# Altium project Eslam.PrjPcb
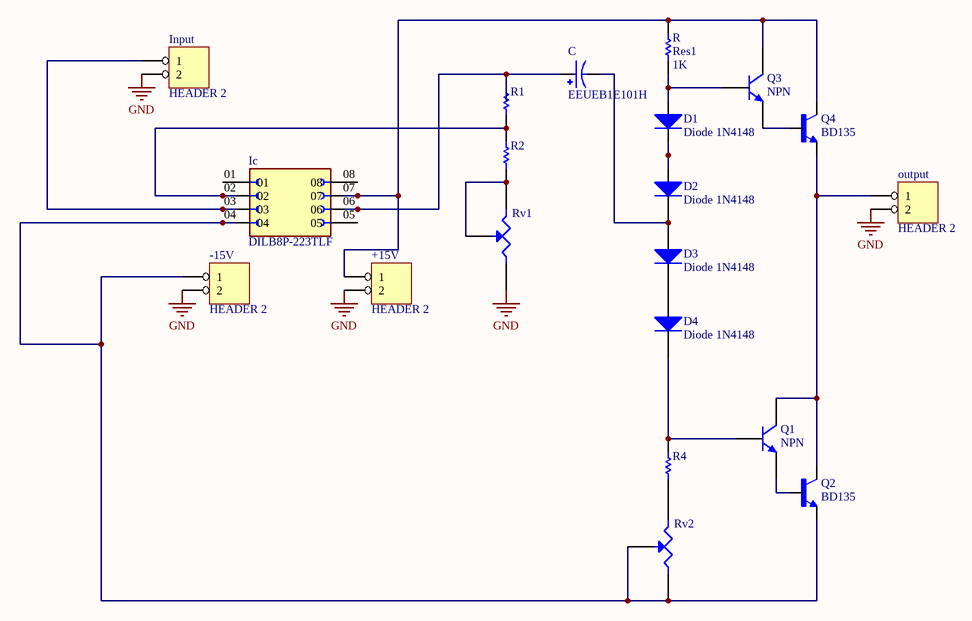
[diagram p0: Sheet1.SchDoc]
1 sheet, 20 parts. Net scope: global (net labels, ports and power ports of the same name join across sheets).
Board file: PCB1.PcbDoc

## Sheet Sheet1.SchDoc
size A; SheetNumber: 1; SheetTotal: 1; SPICEModelCacheRGWDUTJM: <root> / <DocumentId>RGWDUTJM</DocumentId> / <CacheFrame Number="0"> / <Model Name="npn" Kind="MDL"> / <Text>*Default NPN BJT / *NPN Trans Pinout: C,B,E / .MODEL NPN NPN()</Text> / </Model> / <Model Name="1n4148" Kind="MDL"> / <Text>.model 1N4148  D(Is=0.1p Rs=16 CJO=2p Tt=12n Bv=100 Ibv=0.1p)</Text> / </Model> / </CacheFrame> / </root>

### Parts
+15V  HEADER 2  [RAD0.2]
-15V  HEADER 2  [RAD0.2]
C  EEUEB1E101H  [CAPPRD250W50D630H1500]
D1  Diode 1N4148  [DO-35]
D2  Diode 1N4148  [DO-35]
D3  Diode 1N4148  [DO-35]
D4  Diode 1N4148  [DO-35]
Ic  DILB8P-223TLF  [AMPHENOL_DILB8P-223TLF]
Input  HEADER 2  [RAD0.2]
output  HEADER 2  [RAD0.2]
Q1  NPN  [TO-226-AA]
Q2  BD135  [TO229P780X300X2000-3]
Q3  NPN  [TO-226-AA]
Q4  BD135  [TO229P780X300X2000-3]
R  Res1  value 1K  [AXIAL-0.3]
R1  (no value)  [AXIAL-0.3]
R2  (no value)  [AXIAL-0.3]
R4  (no value)  [AXIAL-0.3]
Rv1  (no value)  [POT]
Rv2  (no value)  [POT]

### Nets
GND: +15V.2 -15V.2 Input.2 output.2 Rv1.1
Net+15V_1: +15V.1 Ic.07 Q3.1(C) Q4.2(C) R.2
Net-15V_1: -15V.1 Ic.04 Q2.1(E) Rv2.1 Rv2.2
NetC_N: C.N D2.2(K) D3.1(A)
NetC_P: C.P Ic.06 R1.2
NetD1_1: D1.1(A) Q3.2(B) R.1
NetD1_2: D1.2(K) D2.1(A)
NetD3_2: D3.2(K) D4.1(A)
NetD4_2: D4.2(K) Q1.2(B) R4.2
NetIc_02: Ic.02 R1.1 R2.2
NetIc_03: Ic.03 Input.1
Netoutput_1: output.1 Q1.1(C) Q2.2(C) Q4.1(E)
NetQ1_3: Q1.3(E) Q2.3(B)
NetQ3_3: Q3.3(E) Q4.3(B)
NetR2_1: R2.1 Rv1.2 Rv1.3
NetR4_1: R4.1 Rv2.3

Not connected (* = marked no-connect by the designer): Ic 01 05 08

### Library data of the parts
C = EEUEB1E101H: CAP ALUM 100UF 20% 25V RADIAL; MP: EEU-EB1E101H; MF: Panasonic Electronic Components; Package: RADIAL-2 Panasonic; SnapEDA_Link: https://www.snapeda.com/parts/EEU-EB1E101H/Panasonic/view-part/6221297/?ref=snap; Check_prices: https://www.snapeda.com/parts/EEU-EB1E101H/Panasonic/view-part/6221297/?ref=eda; Price: None; Value: *; Availability: Not in stock
D1-D4 = Diode 1N4148: High Conductance Fast Diode; Published: 8-Jun-2000; LatestRevisionDate: 17-Jul-2002; LatestRevisionNote: Re-released for DXP Platform.; DatasheetVersion: 1997; PackageReference: DO-35; Publisher: Altium Limited; PackageDescription: Diode, Axial; Body 3.8 x 1.9 mm (LxDia. max), Lead Dia. 0.53 mm (max); Code_JEDEC: DO-204-AH; ComponentLink1Description: Manufacturer Link; ComponentLink1URL: http://www.fairchildsemi.com/; ComponentLink2Description: Datasheet; ComponentLink2URL: http://www.fairchildsemi.com/ds/1N%2F1N4148.pdf
Ic = DILB8P-223TLF: DIP Socket, Stamped and Formed; MF: Amphenol ICC; MP: DILB8P-223TLF; SnapEDA_Link: https://www.snapeda.com/parts/DILB8P-223TLF/Amphenol+FCI/view-part/?ref=snap; Availability: In Stock; Package: None; Check_prices: https://www.snapeda.com/parts/DILB8P-223TLF/Amphenol+FCI/view-part/?ref=eda; Value: *; Purchase-URL: https://pricing.snapeda.com/search/part/DILB8P-223TLF/?ref=eda; Price: None
Q1 Q3 = NPN: NPN Bipolar Transistor; Published: 8-Jun-2000; LatestRevisionDate: 17-Jul-2002; LatestRevisionNote: Re-released for DXP Platform.; PackageReference: TO-226-AA; Publisher: Altium Limited; PackageDescription: TO, Flat Index; 3 In-Line, Axial Leads; Body Dia. 4.8mm; Leads 0.55 x 0.51 mm (max); Code_JEDEC: TO-226-AA
Q2 Q4 = BD135: TRANSISTOR, NPN, TO-126; Transistor Polarity:NPN; Collector Emitter Voltage V(br)ceo:45V; Power Dissipation Pd:12.5W; DC Collector Current:1A; DC Current Gain hFE:40; Transistor Case Style:TO-126; No. of Pins:3; SVHC:No SVHC (18-Jun-2012); Collector Emitter Voltage Vces:500mV; Continuous Collector Current Ic Max:1A; Current Ic Continuous a Max:1A; Current Ic hFE:150mA; Full Power Rating Temperature:25Â°C; Hfe Min:40; No. of Transistors:1; Package / Case:TO-126; Power Dissipation Pd:12.5W; Power Dissipation Ptot Max:12.5W; Termination Type:Through Hole; Voltage Vcbo:45V; MF: ON Semiconductor; Availability: In Stock; SnapEDA_Link: https://www.snapeda.com/parts/BD135/Onsemi/view-part/?ref=snap; Price: None; Check_prices: https://www.snapeda.com/parts/BD135/Onsemi/view-part/?ref=eda; Package: TO-225-3 ON Semiconductor; MP: BD135; Value: *; Purchase-URL: https://pricing.snapeda.com/search/part/BD135/?ref=eda
R R1 R2 R4 = Res1: Resistor; Published: 8-Jun-2000; LatestRevisionDate: 17-Jul-2002; LatestRevisionNote: Re-released for DXP Platform.; PackageReference: AXIAL-0.3; Publisher: Altium Limited; PackageDescription: Axial Device, Thru-Hole; 2 Leads; 0.3 in Pin Spacing
Rv1 Rv2 = POTENTIOMETER